# EAGLE design SPI (EAGLE 9.6.2)

## Sheet 1 of 3: µController
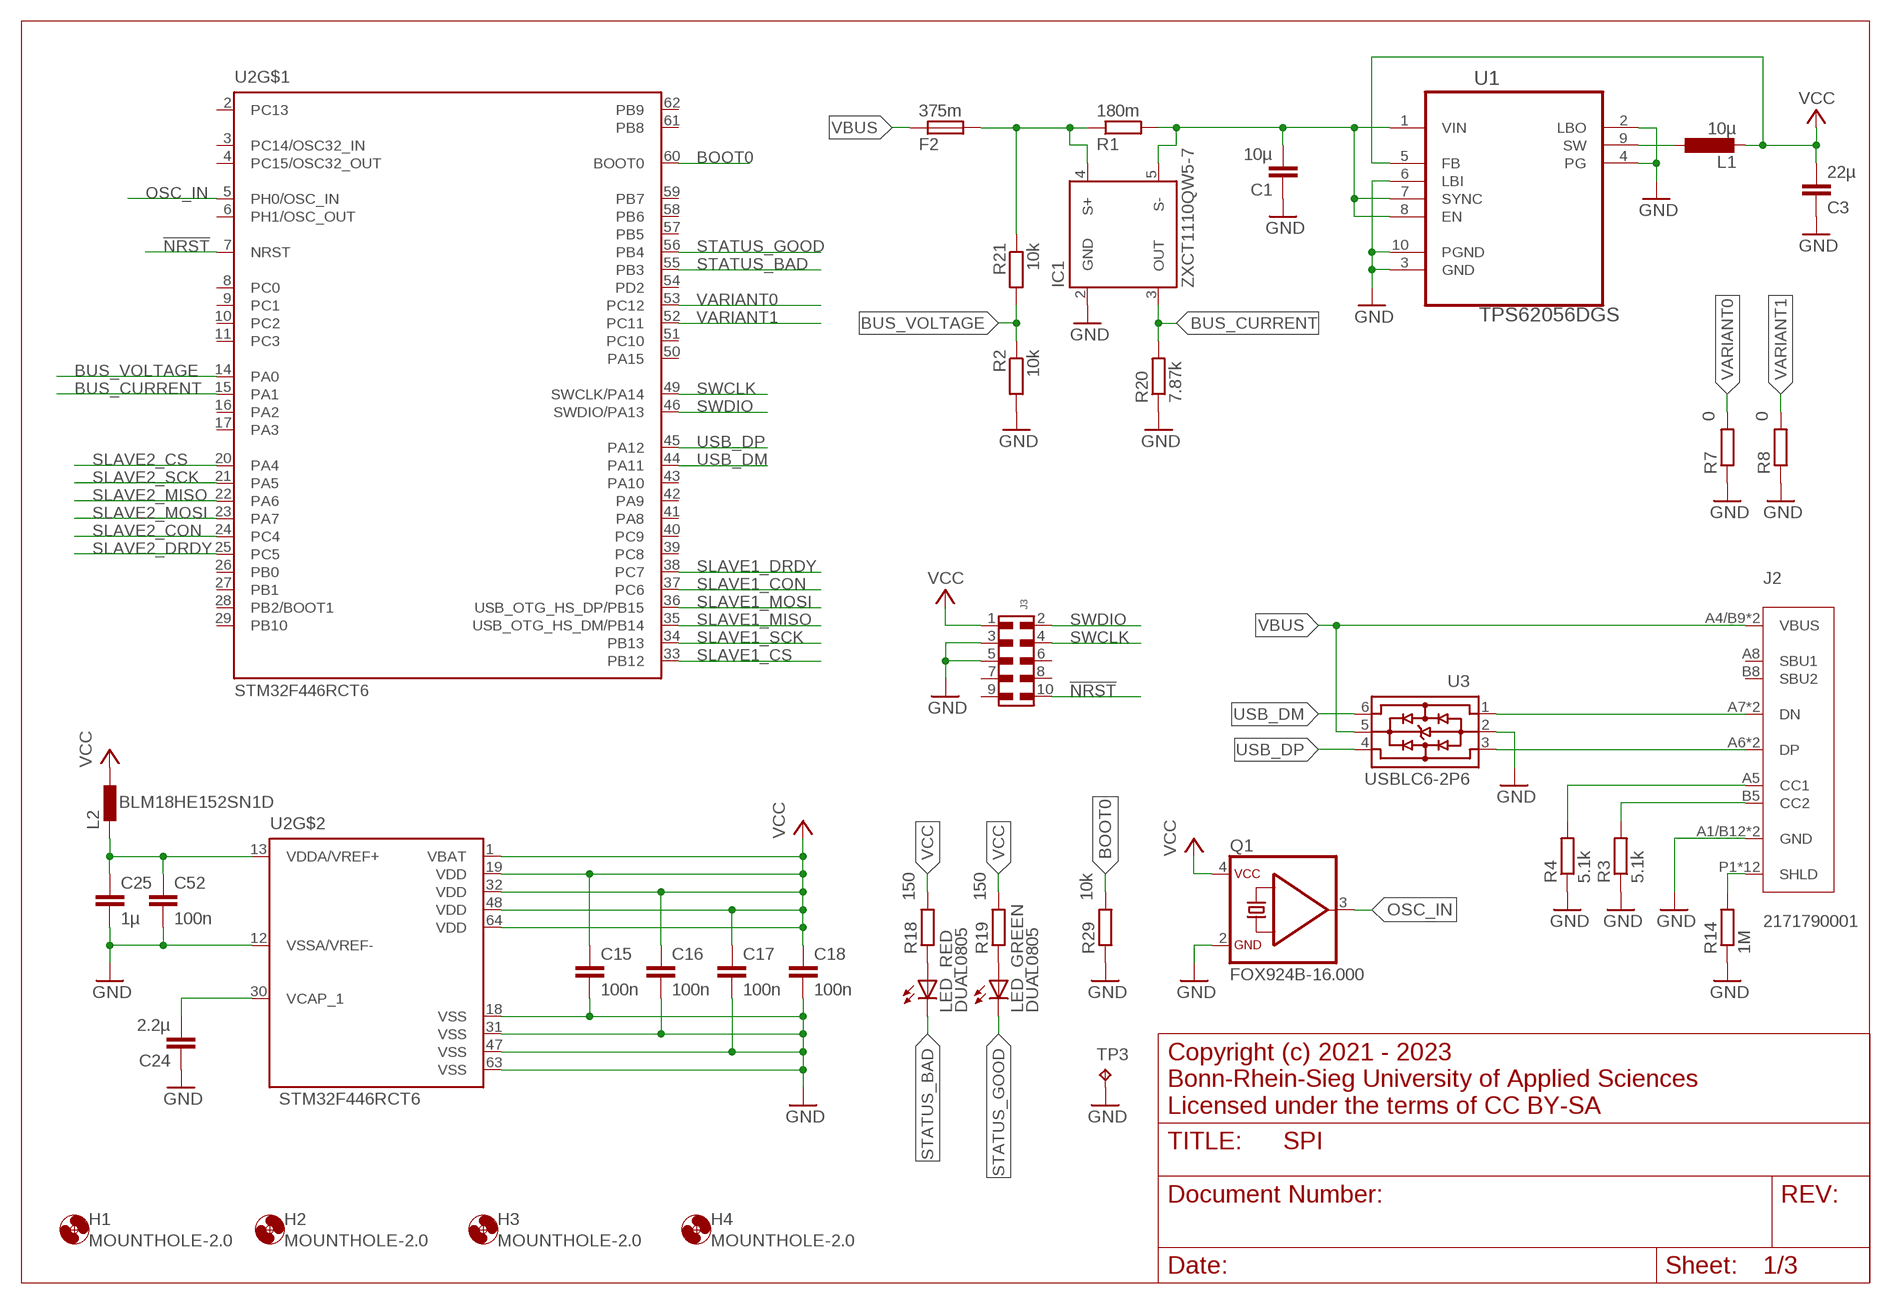
[diagram p0: schematic, sheet 1]

### Parts
C1  10µ  C-EUC0603  [C0603]
C3  22µ  C-EUC0603  [C0603]
C15  100n  C-EUC0603  [C0603]
C16  100n  C-EUC0603  [C0603]
C17  100n  C-EUC0603  [C0603]
C18  100n  C-EUC0603  [C0603]
C24  2.2µ  C-EUC0603  [C0603]
C25  1µ  C-EUC0603  [C0603]
C52  100n  C-EUC0603  [C0603]
F2  375m  FUSE0603  [R0603]
H1  MOUNTHOLE-2.0  [2.0]
H2  MOUNTHOLE-2.0  [2.0]
H3  MOUNTHOLE-2.0  [2.0]
H4  MOUNTHOLE-2.0  [2.0]
IC1  ZXCT1110QW5-7  [SOT23-5L]
J2  2171790001  [2171790001_MOL]
J3  6210XX21021_62101021021  [62101021021]
L1  10µ  VLS3012ET-100M  [2SMD]
L2  BLM18HE152SN1D  [0603]
LED_  DUAL0805  [CHIPLEDX2]
Q1  FOX924B-16.000  [FOX924B]
R1  180m  R-EU_R0603  [R0603]
R2  10k  R-EU_R0603  [R0603]
R3  5.1k  R-EU_R0603  [R0603]
R4  5.1k  R-EU_R0603  [R0603]
R7  0  R-EU_R0603  [R0603]
R8  0  R-EU_R0603  [R0603]
R14  1M  R-EU_R0603  [R0603]
R18  150  R-EU_R0603  [R0603]
R19  150  R-EU_R0603  [R0603]
R20  7.87k  R-EU_R0603  [R0603]
R21  10k  R-EU_R0603  [R0603]
R29  10k  R-EU_R0603  [R0603]
TP3  TP3.8X2.03  [3.8X2.03]
U1  TPS62056DGS  [SOP50P490X110-10N]
U2  STM32F446RCT6  [LQFP64]
U3  USBLC6-2P6  [SOT-666]

### Nets
!NRST: J3.10 U2.7(NRST)
BOOT0: R29.2 U2.60(BOOT0)
BUS_CURRENT: IC1.3(OUT) R20.2 U2.15(PA1)
BUS_VOLTAGE: R2.1 R21.2 U2.14(PA0)
GND: C1.1 C3.1 C15.2 C16.2 C17.2 C18.2 C24.1 C25.2 C52.2 IC1.2(GND) J2.A1/B12(GND) J2.B1/A12(GND) J3.3 J3.5 Q1.2(GND) R2.2 R3.1 R4.1 R7.1 R8.1 R14.1 R20.1 R29.1 TP3.TP U1.2(LBO) U1.3(GND) U1.4(PG) U1.6(LBI) U1.10(PGND) U2.12(VSSA/VREF-) U2.18(VSS) U2.31(VSS) U2.47(VSS) U2.63(VSS) U3.2 ; also sheet 2,3
N$1: J2.P1(SHLD) J2.P2(SHLD) J2.P3(SHLD) J2.P4(SHLD) J2.S1(SHLD) J2.S2(SHLD) J2.S3(SHLD) J2.S4(SHLD) J2.S5(SHLD) J2.S6(SHLD) J2.S7(SHLD) J2.S8(SHLD) R14.2
N$2: C1.2 IC1.5(S-) R1.2 U1.1(VIN) U1.7(SYNC) U1.8(EN)
N$3: L1.P$1 U1.9(SW)
N$4: J2.A6(DP) J2.B6(DP) U3.3
N$5: J2.A7(DN) J2.B7(DN) U3.1
N$6: J2.B5(CC2) R3.2
N$7: J2.A5(CC1) R4.2
N$11: C25.1 C52.1 L2.2 U2.13(VDDA/VREF+)
N$18: F2.2 IC1.4(S+) R1.1 R21.1
N$24: C24.2 U2.30(VCAP_1)
N$28: LED_.A1(RED:A) R18.1
N$29: LED_.A2(GREEN:A) R19.1
OSC_IN: Q1.3(OUT) U2.5(PH0/OSC_IN)
SLAVE1_CON: U2.37(PC6) ; also sheet 2
SLAVE1_CS: U2.33(PB12) ; also sheet 2
SLAVE1_DRDY: U2.38(PC7) ; also sheet 2
SLAVE1_MISO: U2.35(USB_OTG_HS_DM/PB14) ; also sheet 2
SLAVE1_MOSI: U2.36(USB_OTG_HS_DP/PB15) ; also sheet 2
SLAVE1_SCK: U2.34(PB13) ; also sheet 2
SLAVE2_CON: U2.24(PC4) ; also sheet 3
SLAVE2_CS: U2.20(PA4) ; also sheet 3
SLAVE2_DRDY: U2.25(PC5) ; also sheet 3
SLAVE2_MISO: U2.22(PA6) ; also sheet 3
SLAVE2_MOSI: U2.23(PA7) ; also sheet 3
SLAVE2_SCK: U2.21(PA5) ; also sheet 3
STATUS_BAD: LED_.C1(RED:C) U2.55(PB3)
STATUS_GOOD: LED_.C2(GREEN:C) U2.56(PB4)
SWCLK: J3.4 U2.49(SWCLK/PA14)
SWDIO: J3.2 U2.46(SWDIO/PA13)
USB_DM: U2.44(PA11) U3.6
USB_DP: U2.45(PA12) U3.4
VARIANT0: R7.2 U2.53(PC12)
VARIANT1: R8.2 U2.52(PC11)
VBUS: F2.1 J2.A4/B9(VBUS) J2.B4/A9(VBUS) U3.5
VCC: C3.2 C15.1 C16.1 C17.1 C18.1 J3.1 L1.P$2 L2.1 Q1.4(VCC) R18.2 R19.2 U1.5(FB) U2.1(VBAT) U2.19(VDD) U2.32(VDD) U2.48(VDD) U2.64(VDD) ; also sheet 2,3
Unconnected: J2.A8(SBU1) J2.B8(SBU2) J3.6 J3.7 J3.8 J3.9 U2.2(PC13) U2.3(PC14/OSC32_IN) U2.4(PC15/OSC32_OUT) U2.6(PH1/OSC_OUT) U2.8(PC0) U2.9(PC1) U2.10(PC2) U2.11(PC3) U2.16(PA2) U2.17(PA3) U2.26(PB0) U2.27(PB1) U2.28(PB2/BOOT1) U2.29(PB10) U2.39(PC8) U2.40(PC9) U2.41(PA8) U2.42(PA9) U2.43(PA10) U2.50(PA15) U2.51(PC10) U2.54(PD2) U2.57(PB5) U2.58(PB6) U2.59(PB7) U2.61(PB8) U2.62(PB9)

### Notes on the sheet
- Copyright (c) 2021 - 2023
  Bonn-Rhein-Sieg University of Applied Sciences
  Licensed under the terms of CC BY-SA

## Sheet 2 of 3: Isolator 1
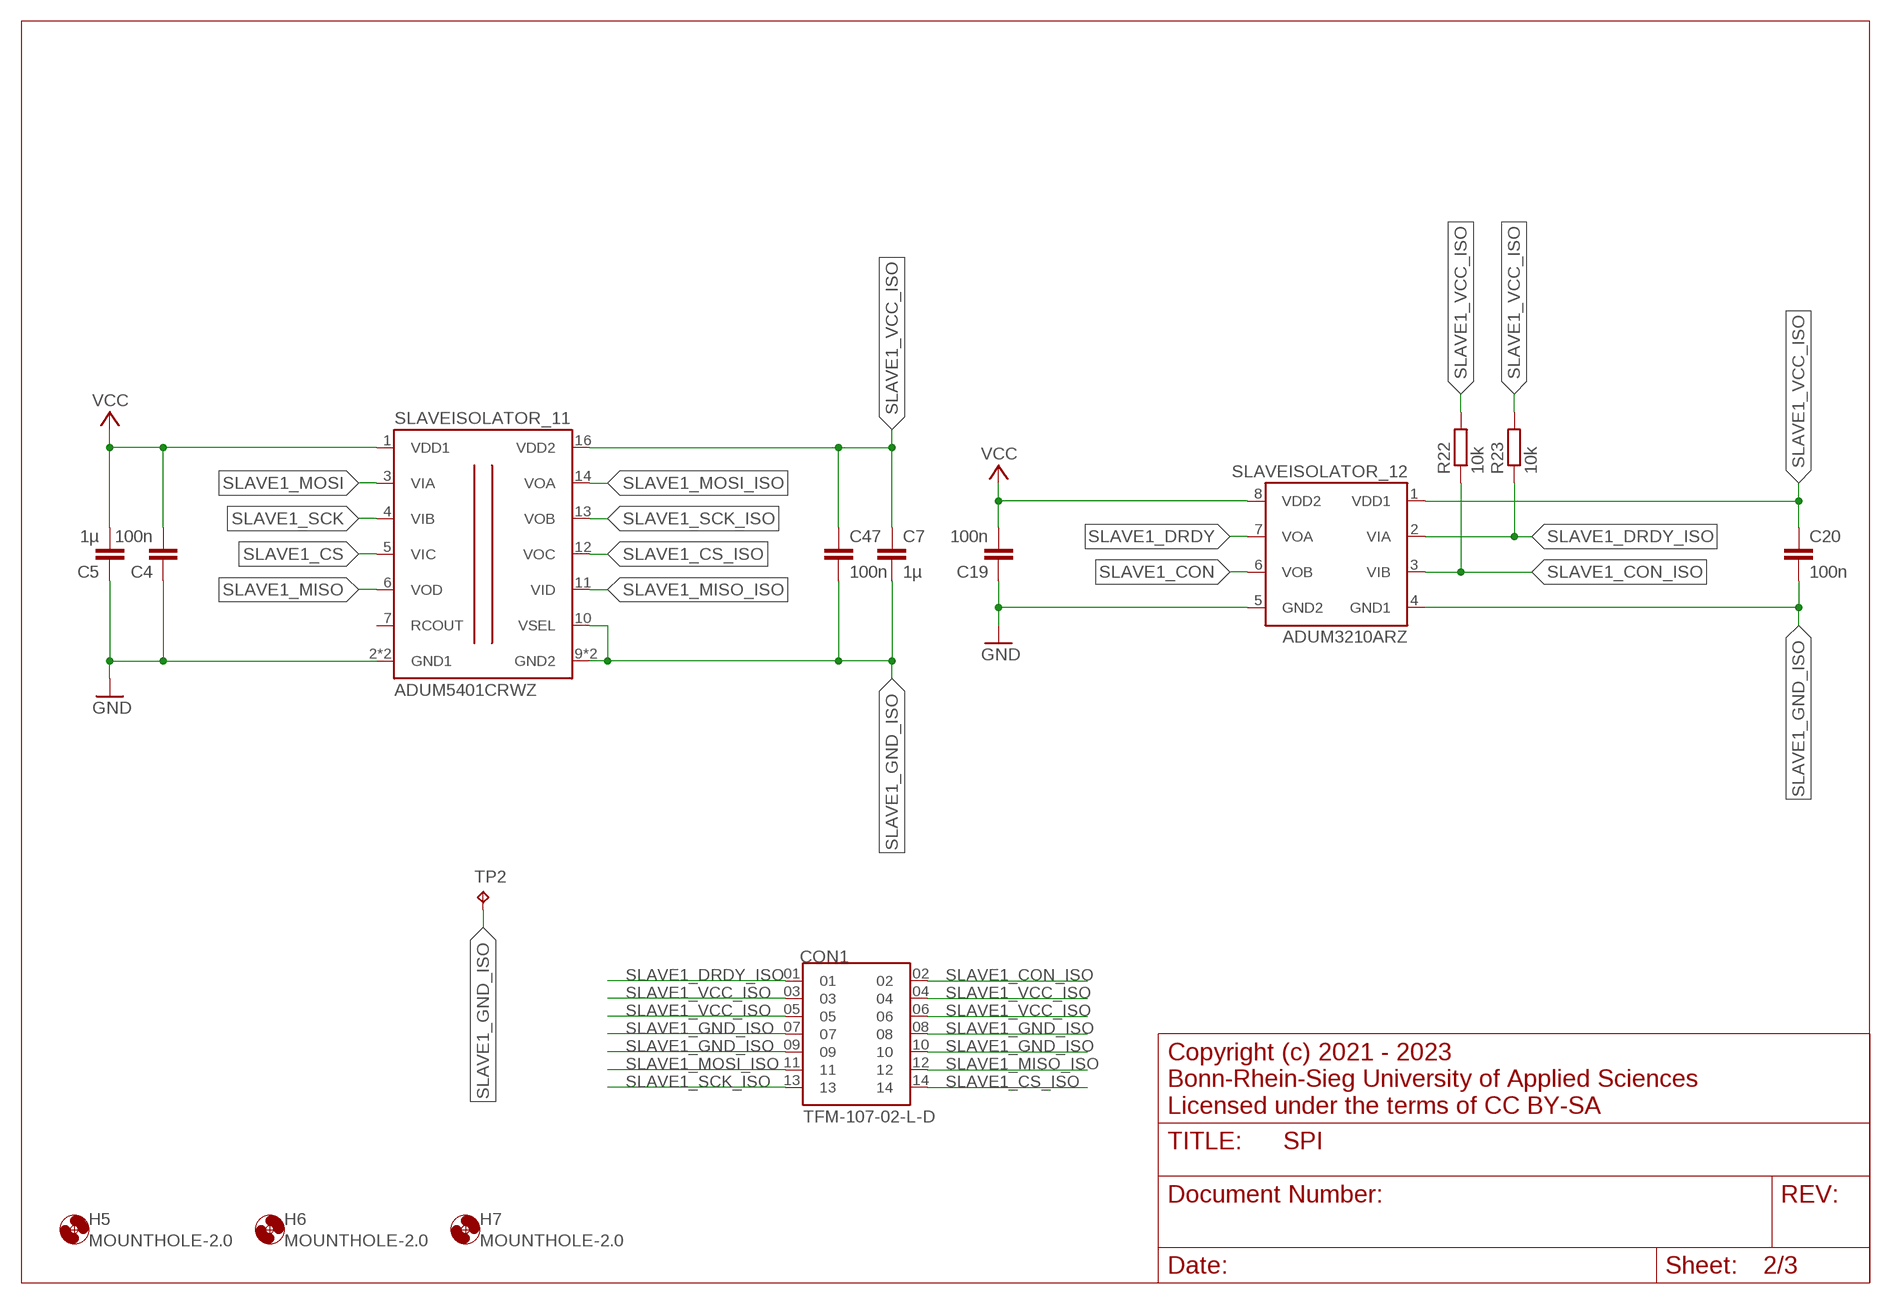
[diagram p1: schematic, sheet 2]

### Parts
C4  100n  C-EUC0603  [C0603]
C5  1µ  C-EUC0603  [C0603]
C7  1µ  C-EUC0603  [C0603]
C19  100n  C-EUC0603  [C0603]
C20  100n  C-EUC0603  [C0603]
C47  100n  C-EUC0603  [C0603]
CON1  TFM-107-02-L-D  [SAMTEC_TFM-107-02-L-D]
H5  MOUNTHOLE-2.0  [2.0]
H6  MOUNTHOLE-2.0  [2.0]
H7  MOUNTHOLE-2.0  [2.0]
R22  10k  R-EU_R0603  [R0603]
R23  10k  R-EU_R0603  [R0603]
SLAVEISOLATOR_11  ADUM5401CRWZ  [SO16W]
SLAVEISOLATOR_12  ADUM3210ARZ  [SOIC8]
TP2  TP3.8X2.03  [3.8X2.03]

### Nets
GND: C4.1 C5.1 C19.1 SLAVEISOLATOR_11.2(GND1) SLAVEISOLATOR_11.8(GND1) SLAVEISOLATOR_12.5(GND2) ; also sheet 1,3
SLAVE1_CON: SLAVEISOLATOR_12.6(VOB) ; also sheet 1
SLAVE1_CON_ISO: CON1.02 R22.1 SLAVEISOLATOR_12.3(VIB)
SLAVE1_CS: SLAVEISOLATOR_11.5(VIC) ; also sheet 1
SLAVE1_CS_ISO: CON1.14 SLAVEISOLATOR_11.12(VOC)
SLAVE1_DRDY: SLAVEISOLATOR_12.7(VOA) ; also sheet 1
SLAVE1_DRDY_ISO: CON1.01 R23.1 SLAVEISOLATOR_12.2(VIA)
SLAVE1_GND_ISO: C7.2 C20.2 C47.2 CON1.07 CON1.08 CON1.09 CON1.10 SLAVEISOLATOR_11.9(GND2) SLAVEISOLATOR_11.10(VSEL) SLAVEISOLATOR_11.15(GND2) SLAVEISOLATOR_12.4(GND1) TP2.TP
SLAVE1_MISO: SLAVEISOLATOR_11.6(VOD) ; also sheet 1
SLAVE1_MISO_ISO: CON1.12 SLAVEISOLATOR_11.11(VID)
SLAVE1_MOSI: SLAVEISOLATOR_11.3(VIA) ; also sheet 1
SLAVE1_MOSI_ISO: CON1.11 SLAVEISOLATOR_11.14(VOA)
SLAVE1_SCK: SLAVEISOLATOR_11.4(VIB) ; also sheet 1
SLAVE1_SCK_ISO: CON1.13 SLAVEISOLATOR_11.13(VOB)
SLAVE1_VCC_ISO: C7.1 C20.1 C47.1 CON1.03 CON1.04 CON1.05 CON1.06 R22.2 R23.2 SLAVEISOLATOR_11.16(VDD2) SLAVEISOLATOR_12.1(VDD1)
VCC: C4.2 C5.2 C19.2 SLAVEISOLATOR_11.1(VDD1) SLAVEISOLATOR_12.8(VDD2) ; also sheet 1,3
Unconnected: SLAVEISOLATOR_11.7(RCOUT)

### Notes on the sheet
- Copyright (c) 2021 - 2023
  Bonn-Rhein-Sieg University of Applied Sciences
  Licensed under the terms of CC BY-SA

## Sheet 3 of 3: Isolator 2
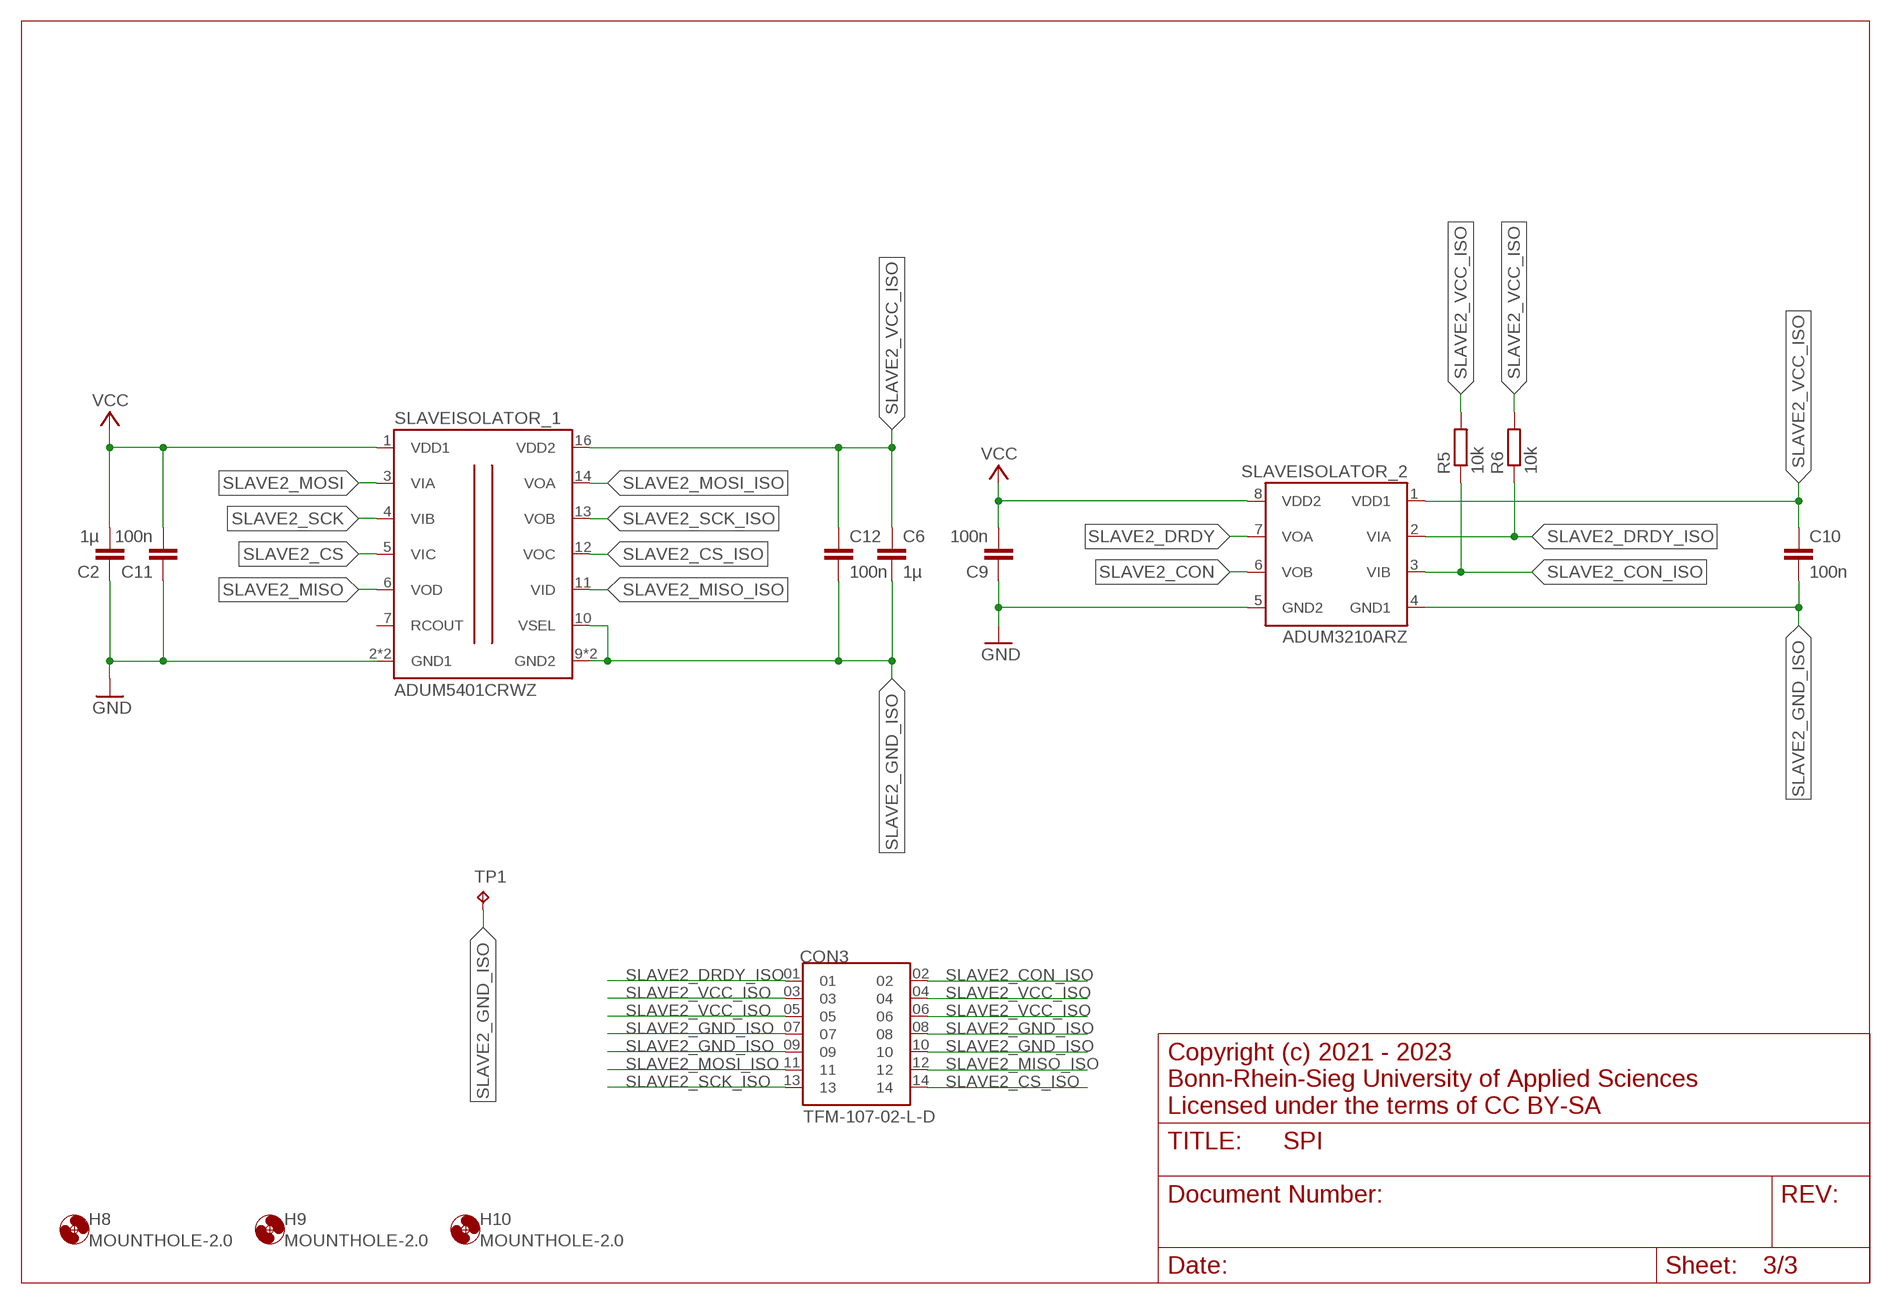
[diagram p2: schematic, sheet 3]

### Parts
C2  1µ  C-EUC0603  [C0603]
C6  1µ  C-EUC0603  [C0603]
C9  100n  C-EUC0603  [C0603]
C10  100n  C-EUC0603  [C0603]
C11  100n  C-EUC0603  [C0603]
C12  100n  C-EUC0603  [C0603]
CON3  TFM-107-02-L-D  [SAMTEC_TFM-107-02-L-D]
H8  MOUNTHOLE-2.0  [2.0]
H9  MOUNTHOLE-2.0  [2.0]
H10  MOUNTHOLE-2.0  [2.0]
R5  10k  R-EU_R0603  [R0603]
R6  10k  R-EU_R0603  [R0603]
SLAVEISOLATOR_1  ADUM5401CRWZ  [SO16W]
SLAVEISOLATOR_2  ADUM3210ARZ  [SOIC8]
TP1  TP3.8X2.03  [3.8X2.03]

### Nets
GND: C2.1 C9.1 C11.1 SLAVEISOLATOR_1.2(GND1) SLAVEISOLATOR_1.8(GND1) SLAVEISOLATOR_2.5(GND2) ; also sheet 1,2
SLAVE2_CON: SLAVEISOLATOR_2.6(VOB) ; also sheet 1
SLAVE2_CON_ISO: CON3.02 R5.1 SLAVEISOLATOR_2.3(VIB)
SLAVE2_CS: SLAVEISOLATOR_1.5(VIC) ; also sheet 1
SLAVE2_CS_ISO: CON3.14 SLAVEISOLATOR_1.12(VOC)
SLAVE2_DRDY: SLAVEISOLATOR_2.7(VOA) ; also sheet 1
SLAVE2_DRDY_ISO: CON3.01 R6.1 SLAVEISOLATOR_2.2(VIA)
SLAVE2_GND_ISO: C6.2 C10.2 C12.2 CON3.07 CON3.08 CON3.09 CON3.10 SLAVEISOLATOR_1.9(GND2) SLAVEISOLATOR_1.10(VSEL) SLAVEISOLATOR_1.15(GND2) SLAVEISOLATOR_2.4(GND1) TP1.TP
SLAVE2_MISO: SLAVEISOLATOR_1.6(VOD) ; also sheet 1
SLAVE2_MISO_ISO: CON3.12 SLAVEISOLATOR_1.11(VID)
SLAVE2_MOSI: SLAVEISOLATOR_1.3(VIA) ; also sheet 1
SLAVE2_MOSI_ISO: CON3.11 SLAVEISOLATOR_1.14(VOA)
SLAVE2_SCK: SLAVEISOLATOR_1.4(VIB) ; also sheet 1
SLAVE2_SCK_ISO: CON3.13 SLAVEISOLATOR_1.13(VOB)
SLAVE2_VCC_ISO: C6.1 C10.1 C12.1 CON3.03 CON3.04 CON3.05 CON3.06 R5.2 R6.2 SLAVEISOLATOR_1.16(VDD2) SLAVEISOLATOR_2.1(VDD1)
VCC: C2.2 C9.2 C11.2 SLAVEISOLATOR_1.1(VDD1) SLAVEISOLATOR_2.8(VDD2) ; also sheet 1,2
Unconnected: SLAVEISOLATOR_1.7(RCOUT)

### Notes on the sheet
- Copyright (c) 2021 - 2023
  Bonn-Rhein-Sieg University of Applied Sciences
  Licensed under the terms of CC BY-SA

## Library data of the parts
C1 C3 = rcl:C-EU: CAPACITOR, European symbol; SPICEPREFIX: C
C2 C4-C7 C9-C12 C15-C20 C24 C25 C47 C52 = rcl:C-EU: CAPACITOR, European symbol
CON1 CON3 = TFM-10x-02-L-D:TFM-107-02-L-D; DESCRIPTION: Connector Header Surface Mount, Right Angle 14 position 0.050 (1.27mm); DIGI-KEY_PART_NUMBER: SAM14682TR-ND; MF: Samtec; MP: TFM-107-02-L-D; PACKAGE: None; PURCHASE-URL: https://pricing.snapeda.com/search/part/TFM-107-02-L-D/?ref=eda
F2 = Fuse0603:FUSE: Surface mount fuse
H1-H10 = MountHoles:MOUNTHOLE-2.0
IC1 = ZXCT11xx:ZXCT1110: LOW POWER HIGH-SIDE CURRENT MONITORS
J2 = USB-C:2171790001; COPYRIGHT: Copyright (C) 2021 Ultra Librarian. All rights reserved.; DIGI-KEY_PART_NUMBER_1: 900-2171790001TR-ND; DIGI-KEY_PART_NUMBER_2: 900-2171790001CT-ND; DIGI-KEY_PART_NUMBER_3: 900-2171790001DKR-ND; MANUFACTURER_PART_NUMBER: 2171790001; MFR_NAME: Molex Connector Corporation
J3 = WR-PHD:6210XX21021_62101021021: WR-PHD 1.27 mm SMT Dual Pin Header, H=3.80 mm ARTICLE PROPERTIES: Pins:4;​ 8;​ 10;​ 14;​ 16;​ 20;​ 28;​ 40;​ 44;​ 50 KIND PROPERTIES: Pitch：1.27 mm Quality Class:3 as per CECC 75 301-802 Rows：Dual Gender：Pin Header Type：Straight MATERIAL PROPERTIES: Insulator Material :PA9T Insulator Flammability Rating:UL94 V-0 Contact Material:Copper Alloy Contact Plating:Gold Contact Type:Stamped GENERAL INFORMATION Operating Temperature:-40 up to +105 °C Compliance:Lead free / RoHS ELECTRICAL PROPERTIES: Rated Current:1 A;​ max. IR1:1 A Withstanding Voltage:500 V (AC) Contact Resistance:20 mΩ RISO:1000 MΩ CERTIFICATION UL Approval:E323964 PACKAGING PROPERTIES Packaging:Tube Packaging Unit:228;​ 114;​ 91;​ 65;​ 57;​ 45;​ 32;​ 23;​ 20;​ 18 <https://katalog.we-online.com/media/images/v2/o33195v209%20Family_WR-PDH_621xxx21021.jpg> Details see: https://katalog.we-online.com/en/em/PHD_1_27_SMT_DUAL_PIN_HEADER_6210XX21021 Updated by Yingchun,Shan 2019-10-25 2019 (C) Würth Elektronik; DATASHEET-URL: https://katalog.we-online.com/em/datasheet/62101021021.pdf; GENDER: Pin Header; IR: 1A; MATES: WR-PHD 1.27mm Dual Socket Header/SMT Dual Socket Header,H=4.5mm/SMT Dual Socket Header,H=4.5mm(Reel); PACKAGING: Tube; PART-NUMBER: 62101021021; PINS: 10; ROWS: Dual; TYPE: Straight
L1 = VLS3012E:VLS3012E?-*: Inductors for power circuits
L2 = BLM18H:BLM18H: Chip Ferrite Bead for GHz Noise
LED_ = DualLED:DUAL0805: Kingbright APHBM2012SURKCGKC (www.digikey.de/product-detail/de/kingbright/APHBM2012SURKCGKC/754-1093-1-ND/1747810)
Q1 = FOX924B:FOX924B
R1-R4 R14 R20 R21 = rcl:R-EU_: RESISTOR, European symbol; SPICEPREFIX: R
R5-R8 R18 R19 R22 R23 R29 = rcl:R-EU_: RESISTOR, European symbol
SLAVEISOLATOR_1 SLAVEISOLATOR_11 = ADuM540x:ADUM5401: Quad-Channel, 2.5 kV Isolators with Integrated DC-to-DC Converter
SLAVEISOLATOR_2 SLAVEISOLATOR_12 = ADuM321x:ADUM3210: Dual-Channel Digital Isolators, Enhanced System-Level ESD Reliability
TP1-TP3 = Testpoints:TP: KEYSTONE SURFACE MOUNT TEST POINTS
U1 = Texas Instruments_By_element14_Batch_1:TPS62056DGS: SYNCHRONOUS STEP-DOWN CONVERTER; MPN: TPS62056DGS; OC_FARNELL: 8457999; OC_NEWARK: 35K5019; PACKAGE: MSOP-10; SUPPLIER: Texas Instruments
U2 = STM32:STM32F446R*?: ARM® Cortex®-M4 32b MCU+FPU, 225DMIPS, up to 512kB Flash/128+4KB RAM, USB OTG HS/FS, 17 TIMs, 3 ADCs, 20 comm. interfaces
U3 = USBLC6-2:USBLC6-2: Very low capacitance ESD protection

## Board
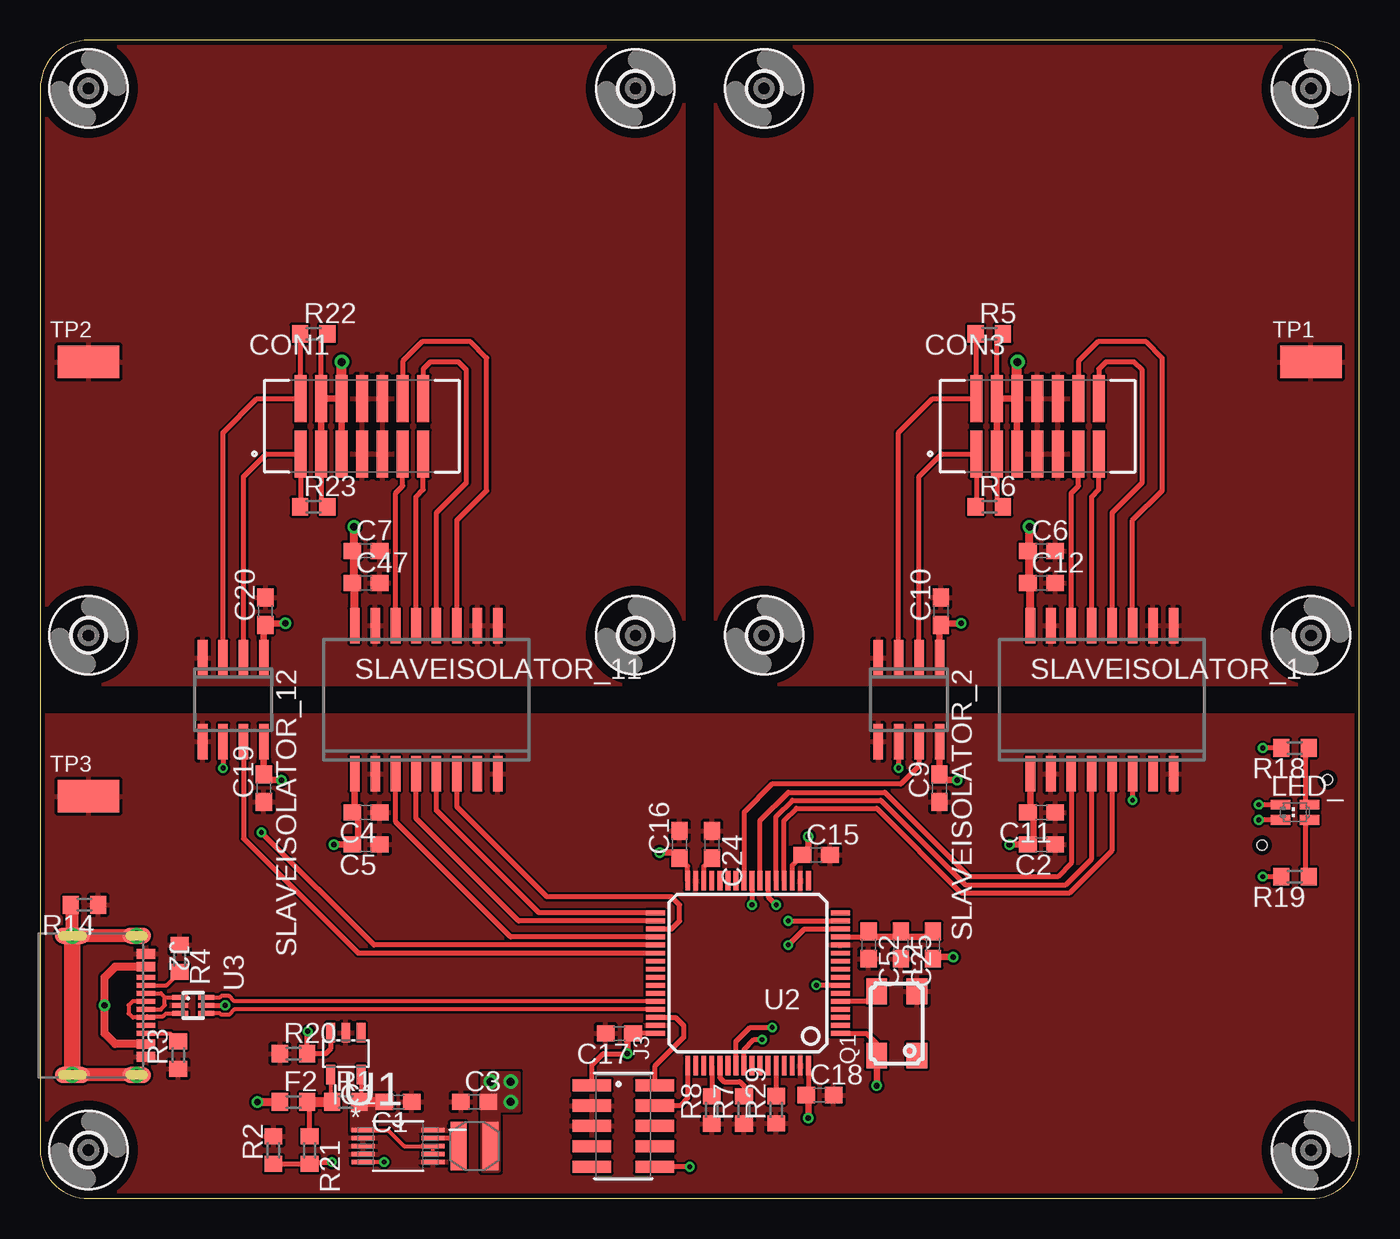
[diagram p3: board, top side]
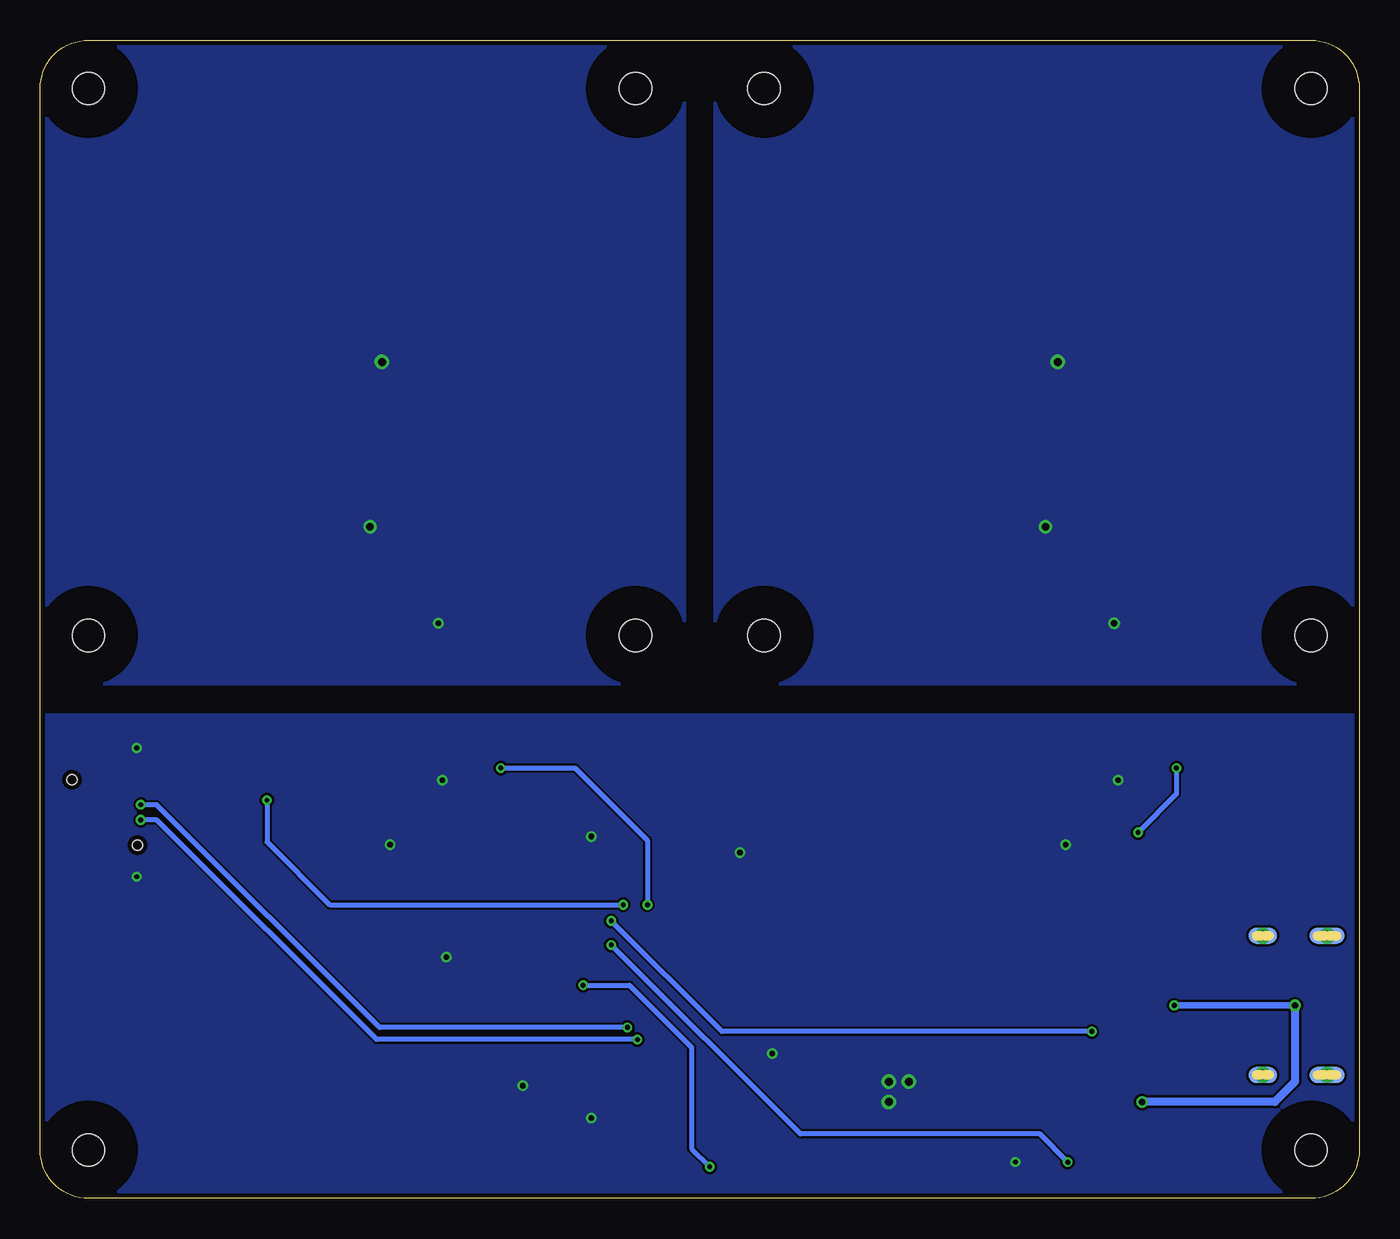
[diagram p4: board, bottom side, seen from below]

Size 82 x 72 mm. Coordinates in mm from the lower left corner, seen from the top.
Outline: 0,3 arc90 3,0 79,0 arc90 82,3 82,69 arc90 79,72 3,72 arc90 0,69 0,3
Copper layers (1*16): Top 0.035mm / dielectric 1.5mm / Bottom 0.035mm
Design rules "PCB-POOL Standard": minimum track width 0.15mm, minimum drill 0.3mm, track to track 0.15mm, track to pad 0.15mm, pad to pad 0.15mm, via to via 0.15mm, smd to smd 0.15mm, copper to edge 0.3mm, drill to drill 0.2mm, minimum pad ring 0.2mm, minimum via ring 0.15mm, stop-mask expansion 0.075mm, vias tented up to drill 0mil, thermal gap 0.2mm
Holes 0.61 mm at 75.97,21.97 80.03,26.03

### Footprints (pad centres in the part's own frame; a part is rotated, then mirrored left to right if it is on the bottom)
C0603 = smd 1.1 x 1: 1 -0.85,0; 2 0.85,0
SAMTEC_TFM-107-02-L-D = smd 0.74 x 2.92: 01 -3.81,-1.715; 02 -3.81,1.715; 03 -2.54,-1.715; 04 -2.54,1.715; 05 -1.27,-1.715; 06 -1.27,1.715; 07 0,-1.715; 08 0,1.715; 09 1.27,-1.715; 10 1.27,1.715; 11 2.54,-1.715; 12 2.54,1.715; 13 3.81,-1.715; 14 3.81,1.715
R0603 = smd 1 x 1.1: 1 -0.85,0; 2 0.85,0
2.0 = hole 2: 0,0
SOT23-5L = smd 0.55 x 1.2: 1 -0.95,-1.3; 2 0,-1.3; 3 0.95,-1.3; 4 0.95,1.3; 5 -0.95,1.3
2171790001_MOL = smd 0.6 x 1.15: A1/B12 -3.2,2.575; A4/B9 -2.4,2.575; B1/A12 3.2,2.575; B4/A9 2.4,2.575 | smd 0.3 x 1.15: A5 -1.25,2.575; A6 -0.25,2.575; A7 0.25,2.575; A8 1.25,2.575; B5 1.75,2.575; B6 0.75,2.575; B7 -0.75,2.575; B8 -1.75,2.575 | drill 0.6 pad 1: P1 -4.32,2; P2 4.32,2; P3 -4.32,-2; P4 4.32,-2 | smd 1 x 1.8: S1 -4.32,2; S2 4.32,2 | smd 1 x 2.2: S3 -4.32,-2; S4 4.32,-2 | smd 1 x 2.2 bottom: S5 -4.32,-2; S6 4.32,-2 | smd 1 x 1.8 bottom: S7 4.32,2; S8 -4.32,2
62101021021 = smd 0.75 x 2.4: 1 -2.54,-1.95; 2 -2.54,1.95; 3 -1.27,-1.95; 4 -1.27,1.95; 5 0,-1.95; 6 0,1.95; 7 1.27,-1.95; 8 1.27,1.95; 9 2.54,-1.95; 10 2.54,1.95
2SMD = smd 1 x 3: P$1 -1,0; P$2 1,0
0603 = smd 1.1 x 1: 1 -0.85,0; 2 0.85,0
CHIPLEDX2 = smd 0.6 x 1.2: A1 -0.475,0.9; A2 0.475,0.9; C1 -0.475,-0.9; C2 0.475,-0.9
FOX924B = smd 1.6 x 1.3: 1 -2,-1.25; 2 2,-1.25; 3 2,1.25; 4 -2,1.25
SO16W = smd 0.6 x 2.2: 1 -4.445,-4.6; 2 -3.175,-4.6; 3 -1.905,-4.6; 4 -0.635,-4.6; 5 0.635,-4.6; 6 1.905,-4.6; 7 3.175,-4.6; 8 4.445,-4.6; 9 4.445,4.6; 10 3.175,4.6; 11 1.905,4.6; 12 0.635,4.6; 13 -0.635,4.6; 14 -1.905,4.6; 15 -3.175,4.6; 16 -4.445,4.6
SOIC8 = smd 0.6 x 2.2: 1 -1.905,-2.6; 2 -0.635,-2.6; 3 0.635,-2.6; 4 1.905,-2.6; 5 1.905,2.6; 6 0.635,2.6; 7 -0.635,2.6; 8 -1.905,2.6
3.8X2.03 = smd 3.8 x 2.03: TP 0,0
SOP50P490X110-10N = smd 1.422 x 0.279: 1 -2.184,0.991; 2 -2.184,0.508; 3 -2.184,0; 4 -2.184,-0.508; 5 -2.184,-0.991; 6 2.184,-0.991; 7 2.184,-0.508; 8 2.184,0; 9 2.184,0.508; 10 2.184,0.991
LQFP64 = smd 0.3 x 1.2: 1 -3.75,-5.75; 2 -3.25,-5.75; 3 -2.75,-5.75; 4 -2.25,-5.75; 5 -1.75,-5.75; 6 -1.25,-5.75; 7 -0.75,-5.75; 8 -0.25,-5.75; 9 0.25,-5.75; 10 0.75,-5.75; 11 1.25,-5.75; 12 1.75,-5.75; 13 2.25,-5.75; 14 2.75,-5.75; 15 3.25,-5.75; 16 3.75,-5.75; 33 3.75,5.75; 34 3.25,5.75; 35 2.75,5.75; 36 2.25,5.75; 37 1.75,5.75; 38 1.25,5.75; 39 0.75,5.75; 40 0.25,5.75; 41 -0.25,5.75; 42 -0.75,5.75; 43 -1.25,5.75; 44 -1.75,5.75; 45 -2.25,5.75; 46 -2.75,5.75; 47 -3.25,5.75; 48 -3.75,5.75 | smd 1.2 x 0.3: 17 5.75,-3.75; 18 5.75,-3.25; 19 5.75,-2.75; 20 5.75,-2.25; 21 5.75,-1.75; 22 5.75,-1.25; 23 5.75,-0.75; 24 5.75,-0.25; 25 5.75,0.25; 26 5.75,0.75; 27 5.75,1.25; 28 5.75,1.75; 29 5.75,2.25; 30 5.75,2.75; 31 5.75,3.25; 32 5.75,3.75; 49 -5.75,3.75; 50 -5.75,3.25; 51 -5.75,2.75; 52 -5.75,2.25; 53 -5.75,1.75; 54 -5.75,1.25; 55 -5.75,0.75; 56 -5.75,0.25; 57 -5.75,-0.25; 58 -5.75,-0.75; 59 -5.75,-1.25; 60 -5.75,-1.75; 61 -5.75,-2.25; 62 -5.75,-2.75; 63 -5.75,-3.25; 64 -5.75,-3.75
SOT-666 = smd 0.3 x 1: 1 -0.5,-0.81; 2 0,-0.81; 3 0.5,-0.81; 4 0.5,0.81; 5 0,0.81; 6 -0.5,0.81

### Placement (x,y rotation side)
C1  22.25,6 180 top
C2  62.25,22 180 top
C3  27,6 0 top
C4  20.25,24 180 top
C5  20.25,22 180 top
C6  62.25,40.25 0 top
C7  20.25,40.25 0 top
C9  55.91,25.5 90 top
C10  56,36.5 90 top
C11  62.25,24 180 top
C12  62.25,38.25 0 top
C15  48.24,21.34 0 top
C16  39.75,22 90 top
C17  36,10.25 180 top
C18  48.47,6.42 0 top
C19  13.9,25.5 90 top
C20  14,36.5 90 top
C24  41.75,22 270 top
C25  53.5,15.75 270 top
C47  20.25,38.25 0 top
C52  51.5,15.75 270 top
CON1  20,48 0 top
CON3  62,48 0 top
F2  15.75,6 0 top
H1  3,3 0 top
H2  79,3 0 top
H3  79,69 0 top
H4  3,69 0 top
H5  3,35 0 top
H6  37,35 0 top
H7  37,69 0 top
H8  45,35 0 top
H9  79,35 0 top
H10  45,69 0 top
IC1  19,9 180 top
J2  4,12 270 top
J3  36.25,4.5 270 top
L1  27,3.25 0 top
L2  55.5,15.75 90 top
LED_  78,24 270 top
Q1  53.25,10.88 90 top
R1  19,6 0 top
R2  14.5,3 90 top
R3  8.58,8.91 90 top
R4  8.67,14.92 270 top
R5  59,53.75 0 top
R6  59,43 0 top
R7  43.75,5.5 90 top
R8  41.75,5.5 90 top
R14  2.75,18.25 180 top
R18  78,28 180 top
R19  78,20 180 top
R20  15.75,9 0 top
R21  16.75,3 270 top
R22  17,53.75 0 top
R23  17,43 0 top
R29  45.75,5.51 90 top
SLAVEISOLATOR_1  66,31 0 top
SLAVEISOLATOR_2  54,31 180 top
SLAVEISOLATOR_11  24,31 0 top
SLAVEISOLATOR_12  12,31 180 top
TP1  79,52 0 top
TP2  3,52 0 top
TP3  3,25 0 top
U1  22.25,3.25 0 top
U2  44,14 90 top
U3  9.5,12 270 top

### Tracks (layer width: path | path; a pad name or v marks a point on that pad's centre or on a via)
!NRST  (via drill 0.3)
  Top 0.305: U2.7 v48.25,13.25 | v40.38,1.96 J3.10
  Bottom 0.305: v48.25,13.25 45.38,13.25 41.5,9.38 41.5,3.08 v40.38,1.96
BOOT0
  Top 0.305: U2.60 R29.2
BUS_CURRENT  (via drill 0.3)
  Top 0.305: IC1.3 18.05,9.3 17.75,9 R20.2 16.6,10.35 v16.62,10.38 | v46.5,17.25 U2.15
  Bottom 0.305: v16.62,10.38 39.62,10.38 v46.5,17.25
BUS_VOLTAGE  (via drill 0.3)
  Top 0.305: R2.1 R21.2 16.85,2.25 v18.12,2.25 | v46.5,15.75 47.5,16.75 U2.14
  Bottom 0.305: v18.12,2.25 19.85,4 34.75,4 v46.5,15.75
GND
  pour Top (rank 2): 3,0 79,0 arc90 82,3 82,30 0,30 0,3 arc90
  pour Top (no thermals): 8.12,12.12 9.38,12.12 9.38,12.88 9.62,12.88 9.62,11.12 9.38,11.12 9.38,11.88 8.12,11.88
  pour Top (no thermals): 25.12,4.25 25.12,4.62 23.12,4.62 23.12,4.25
N$1
  Top 0.813: J2.S8 J2.S5 2,18.15 R14.2 | J2.S7 J2.S6
  Top 1.016: J2.S5 J2.S6
N$2
  Top 0.254: U1.7 U1.8 22.62,3.25 21.63,4.24 U1.1 | IC1.5 19.95,6.1 R1.2
  Top 0.61: R1.2 C1.2
  pour Top (no thermals): 19.38,4.25 20.75,4.25 20.75,5.62 21.88,5.62 21.88,6.38 19.38,6.38
N$3
  Top 0.305: U1.9 25.49,3.76 L1.P$1
N$4
  Top 0.254: J2.A6 5.75,12.25 5.5,12 5.5,11.5 5.75,11.25 J2.B6 6.65,11.32 7.64,11.32 7.82,11.5 U3.3
N$5
  Top 0.254: J2.B7 7.5,12.75 7.75,12.5 | 7.75,12.5 U3.1 | J2.A7 7.5,11.75 7.75,12 7.75,12.5
N$6
  Top 0.254: J2.B5 8.09,10.25 R3.2
N$7
  Top 0.254: J2.A5 7.85,13.25 R4.2
N$11
  Top 0.305: U2.13 51.15,16.25 C52.1
  Top 0.406: C52.1 51.85,16.25 53.15,16.25 C25.1 53.85,16.25 55.15,16.25 L2.2
N$18
  Top 0.254: IC1.4 18.05,6.1 R1.1
  Top 0.305: R21.1 16.75,5.85 F2.2
  Top 0.61: F2.2 R1.1
N$24
  Top 0.305: U2.30 41.25,20.65 C24.2
N$28
  Top 0.305: LED_.A1 78.65,24.73 78.65,27.8 R18.1
N$29
  Top 0.305: LED_.A2 78.65,23.27 78.65,20.2 R19.1
OSC_IN
  Top 0.305: Q1.3 51.38,12.25 U2.5
SLAVE1_CON  (via drill 0.3)
  Top 0.305: U2.37 20.75,15.75 v13.75,22.75 | SLAVEISOLATOR_12.6 v11.37,26.75
  Bottom 0.305: v11.37,26.75 11.37,25.14 v13.75,22.75
SLAVE1_CON_ISO
  Top 0.305: R22.1 16.19,53.71 CON1.02 13.46,49.72 11.37,47.62 SLAVEISOLATOR_12.3
SLAVE1_CS
  Top 0.305: U2.33 31,17.75 24.64,24.11 SLAVEISOLATOR_11.5
SLAVE1_CS_ISO
  Top 0.305: SLAVEISOLATOR_11.12 24.64,42.63 26.5,44.5 26.5,51.5 26,52 24.25,52 23.81,51.56 CON1.14
SLAVE1_DRDY
  Top 0.305: SLAVEISOLATOR_12.7 12.63,22.36 19.75,15.25 U2.38
SLAVE1_DRDY_ISO
  Top 0.305: R23.1 16.19,43.04 CON1.01 14.04,46.28 12.63,44.88 SLAVEISOLATOR_12.2
SLAVE1_GND_ISO
  pour Top: 0,32 40,32 40,72 3,72 arc90 0,69
SLAVE1_MISO
  Top 0.305: U2.35 39.25,16.75 39.75,17.25 39.75,18.25 39.25,18.75 31.5,18.75 25.91,24.34 SLAVEISOLATOR_11.6
SLAVE1_MISO_ISO
  Top 0.305: SLAVEISOLATOR_11.11 25.91,42.16 27.75,44 27.75,52.25 26.75,53.25 23.75,53.25 22.54,52.04 CON1.12
SLAVE1_MOSI
  Top 0.305: U2.36 29.25,16.25 22.09,23.41 SLAVEISOLATOR_11.3
SLAVE1_MOSI_ISO
  Top 0.305: SLAVEISOLATOR_11.14 22.09,43.84 22.54,44.29 CON1.11
SLAVE1_SCK
  Top 0.305: U2.34 29.75,17.25 23.36,23.64 SLAVEISOLATOR_11.4
SLAVE1_SCK_ISO
  Top 0.305: SLAVEISOLATOR_11.13 23.36,43.62 23.81,44.06 CON1.13
SLAVE1_VCC_ISO  (via drill 0.4, 0.45, 0.5)
  Top 0.305: CON1.03 17.46,43.39 R23.2 | CON1.04 17.46,53.36 R22.2
  Top 0.406: CON1.03 CON1.04 CON1.06 | CON1.06 CON1.05 | CON1.06 18.75,49.73 | SLAVEISOLATOR_12.1 13.9,35.55 C20.1 14.1,35.75 v15.25,35.75
  Top 0.508: SLAVEISOLATOR_11.16 19.55,38.09 C47.1 19.5,38.35 19.5,40.15 C7.1 19.5,40.35 v19.5,41.75
  Top 0.61: 18.75,49.73 v18.75,52
  pour Bottom: 0,32 40,32 40,72 3,72 arc90 0,69
SLAVE2_CON  (via drill 0.3)
  Top 0.305: U2.24 v44.25,18.25 | SLAVEISOLATOR_2.6 v53.37,26.75
  Bottom 0.305: v53.37,26.75 48.75,26.75 44.25,22.25 v44.25,18.25
SLAVE2_CON_ISO
  Top 0.305: R5.1 58.19,53.71 CON3.02 55.47,49.72 53.37,47.62 SLAVEISOLATOR_2.3
SLAVE2_CS
  Top 0.305: U2.20 46.25,23.5 47,24.25 52,24.25 57.25,19 64,19 66.64,21.64 SLAVEISOLATOR_1.5
SLAVE2_CS_ISO
  Top 0.305: SLAVEISOLATOR_1.12 66.64,42.63 68.5,44.5 68.5,51.5 68,52 66.25,52 65.81,51.56 CON3.14
SLAVE2_DRDY
  Top 0.305: SLAVEISOLATOR_2.7 54.63,26.89 53.5,25.75 45.5,25.75 43.75,24 U2.25
SLAVE2_DRDY_ISO
  Top 0.305: R6.1 58.19,43.04 CON3.01 56.03,46.28 54.63,44.88 SLAVEISOLATOR_2.2
SLAVE2_GND_ISO
  pour Top: 42,32 82,32 82,68 82,69 arc90 79,72 42,72
SLAVE2_MISO  (via drill 0.3)
  Top 0.305: U2.22 45.25,18.75 v45.75,18.25 | SLAVEISOLATOR_1.6 v67.91,24.75
  Bottom 0.305: v45.75,18.25 64,18.25 67.91,22.16 v67.91,24.75
SLAVE2_MISO_ISO
  Top 0.305: SLAVEISOLATOR_1.11 67.91,42.16 69.75,44 69.75,52.25 68.75,53.25 65.75,53.25 64.54,52.04 CON3.12
SLAVE2_MOSI
  Top 0.305: U2.23 44.75,23.5 46.5,25.25 52.5,25.25 57.75,20 63.25,20 64.09,20.84 SLAVEISOLATOR_1.3
SLAVE2_MOSI_ISO
  Top 0.305: SLAVEISOLATOR_1.14 64.09,43.84 64.54,44.29 CON3.11
SLAVE2_SCK
  Top 0.305: U2.21 45.75,23.75 46.75,24.75 52.25,24.75 57.5,19.5 63.75,19.5 65.36,21.11 SLAVEISOLATOR_1.4
SLAVE2_SCK_ISO
  Top 0.305: SLAVEISOLATOR_1.13 65.36,43.62 65.81,44.06 CON3.13
SLAVE2_VCC_ISO  (via drill 0.35, 0.45, 0.5)
  Top 0.305: CON3.04 59.46,49.75 | 59.46,50 59.46,53.36 R5.2 | CON3.03 59.46,43.39 R6.2
  Top 0.406: CON3.03 59.46,49.75 | 59.46,49.75 59.46,50 | CON3.05 CON3.06 59.49,49.72 59.46,49.75 | SLAVEISOLATOR_2.1 55.91,35.55 C10.1 56.1,35.75 v57.25,35.75
  Top 0.508: SLAVEISOLATOR_1.16 61.55,38.09 C12.1 61.5,38.35 61.5,40.15 C6.1 61.5,40.35 v61.5,41.75
  Top 0.61: CON3.06 60.73,51.98 v60.75,52
  pour Bottom: 42,32 82,32 82,69 arc90 79,72 42,72
STATUS_BAD  (via drill 0.3)
  Top 0.305: U2.55 43.25,9.75 44.12,10.62 v45.5,10.62 | LED_.C1 v75.75,24.48
  Bottom 0.305: v75.75,24.48 74.75,24.48 60.9,10.62 v45.5,10.62
STATUS_GOOD  (via drill 0.3)
  Top 0.305: LED_.C2 v75.75,23.52 | U2.56 43.75,9.25 44.38,9.88 v44.88,9.88
  Bottom 0.305: v75.75,23.52 74.75,23.52 61.1,9.88 v44.88,9.88
SWCLK
  Top 0.305: U2.49 40.25,6.25 39.77,5.77 J3.4
SWDIO
  Top 0.305: U2.46 39.5,11.25 40,10.75 40,10 38.2,8.2 J3.2
USB_DM
  Top 0.254: U3.6 11.18,12.5 11.26,12.58 11.74,12.58 12.07,12.25 U2.44
USB_DP
  Top 0.254: U2.45 12.07,11.75 11.74,11.42 11.26,11.42 11.18,11.5 U3.4
VARIANT0
  Top 0.305: U2.53 42.25,7.5 42.5,7.25 43.5,7.25 43.75,7 R7.2
VARIANT1
  Top 0.305: U2.52 R8.2
VBUS  (via drill 0.3, 0.4)
  Top 0.305: U3.5 v11.5,12
  Top 0.508: J2.A4/B9 4.65,14.4 4,13.75 v4,12 4,10.25 4.65,9.6 J2.B4/A9 | v13.5,6 F2.1
  Bottom 0.406: v11.5,12 v4,12
  Bottom 0.508: v4,12 4,7.25 5.25,6 v13.5,6
VCC  (via drill 0.3, 0.35, 0.5)
  Top 0.254: U1.5 v21.38,2.26
  Top 0.305: U2.64 47.75,6.55 C18.1 | U2.48 C17.1 | U2.32 40.25,20.65 C16.1 | U2.19 46.75,20.7 C15.1 | R18.2 v76,28 | R19.2 v76,20 | U2.1 51.38,10.25 52,9.62 Q1.4 | J3.1 34.3,8.3 35,9 v36.5,9
  Top 0.406: L2.1 55.6,15 v56.75,15 | C18.1 47.75,6.29 v47.75,5 | C17.1 36.5,9.9 v36.5,9 | C16.1 39.4,21.5 v38.5,21.5 | C15.1 47.75,21.7 v47.75,22.5 | SLAVEISOLATOR_2.8 C9.2 56.26,26 v57,26 | SLAVEISOLATOR_12.8 C19.2 14.26,26 v15,26 | SLAVEISOLATOR_1.1 61.55,24.16 C11.2 61.75,23.65 61.75,22.35 C2.2 v60.25,22 | SLAVEISOLATOR_11.1 19.55,24.16 C4.2 19.75,23.65 19.75,22.35 C5.2 v18.25,22 | Q1.4 v52,7
  other vias: 28,7.25 29.25,6 29.25,7.25
  pour Bottom: 0,30 82,30 82,3 arc-90 79,0 3,0 arc-90 0,3
  pour Top (no thermals): 27.5,1.75 28.5,1.75 28.5,5.5 29.75,5.5 29.75,7.75 27.5,7.75

### Text on the board
tStop: SPI Carrier | 1.1 | Marcel Hasler, 2022 | 1 | Hochschule / Bonn-Rhein-Sieg